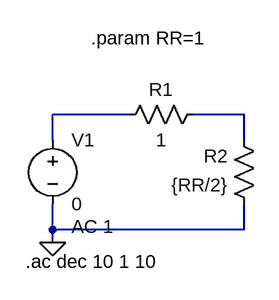
[diagram p0: schematic test.asc]
test.asc, the LTspice schematic file:
Version 4
SHEET 1 880 680
WIRE 48 112 -48 112
WIRE 192 112 128 112
WIRE -48 144 -48 112
WIRE 192 144 192 112
WIRE -48 256 -48 224
WIRE 192 256 192 224
WIRE 192 256 -48 256
WIRE -48 272 -48 256
FLAG -48 272 0
SYMBOL res 144 96 R90
WINDOW 0 0 56 VBottom 2
WINDOW 3 32 56 VTop 2
SYMATTR InstName R1
SYMATTR Value 1
SYMBOL res 208 240 R180
WINDOW 0 36 76 Left 2
WINDOW 3 36 40 Left 2
SYMATTR InstName R2
SYMATTR Value {RR/2}
SYMBOL voltage -48 128 R0
WINDOW 123 24 124 Left 2
WINDOW 39 0 0 Left 0
SYMATTR InstName V1
SYMATTR Value 0
SYMATTR Value2 AC 1
TEXT 0 16 Left 2 !.param RR=1
TEXT -82 296 Left 2 !.ac dec 10 1 10

The netlist it stands for:
* test.asc
R1 N002 N001 1
R2 0 N002 {RR/2}
V1 N001 0 0 AC 1
.param RR=1
.ac dec 10 1 10
.backanno
.end